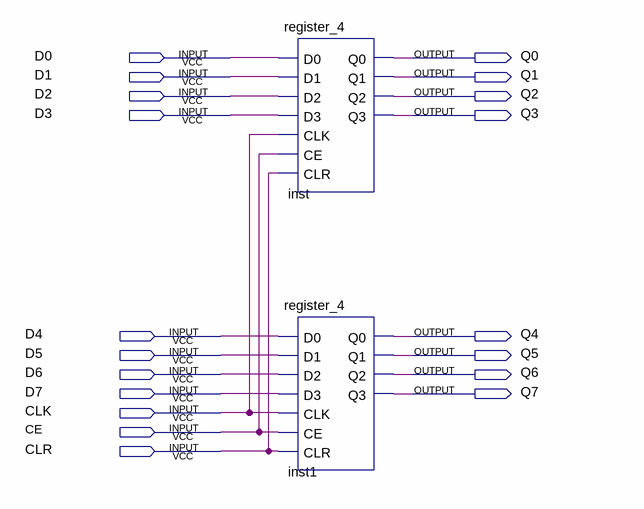
[diagram p0: schematic sheet]
// Quartus schematic register_8.bdf as structural Verilog: 2 symbols, 19 pins
module register_8 (
  input  D0,
  input  D1,
  input  D2,
  input  D3,
  input  D4,
  input  D5,
  input  D6,
  input  D7,
  input  CLK,
  input  CE,
  input  CLR,
  output Q0,
  output Q1,
  output Q2,
  output Q3,
  output Q4,
  output Q5,
  output Q6,
  output Q7
);

  register_4 inst (
    .D0(D0), .D1(D1), .D2(D2), .D3(D3), .CLK(CLK), .CE(CE), .CLR(CLR), .Q0(Q0), .Q1(Q1), .Q2(Q2), .Q3(Q3));
  register_4 inst1 (
    .D0(D4), .D1(D5), .D2(D6), .D3(D7), .CLK(CLK), .CE(CE), .CLR(CLR), .Q0(Q4), .Q1(Q5), .Q2(Q6), .Q3(Q7));
endmodule
